# Altium schematic sheet Calibration.SchDoc
size A3
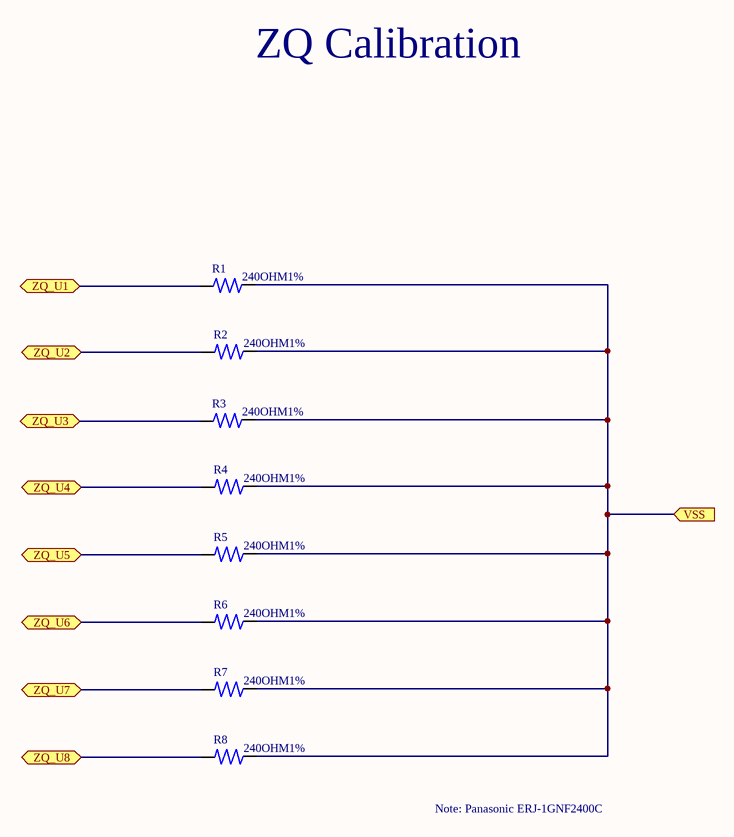
[diagram p0: Calibration.SchDoc]

## Parts
R1  Resistance: 240OHM1%  [Resistor 0402]  (hidden comment: Resistor 0402)
R2  Resistance: 240OHM1%  [Resistor 0402]  (hidden comment: Resistor 0402)
R3  Resistance: 240OHM1%  [Resistor 0402]  (hidden comment: Resistor 0402)
R4  Resistance: 240OHM1%  [Resistor 0402]  (hidden comment: Resistor 0402)
R5  Resistance: 240OHM1%  [Resistor 0402]  (hidden comment: Resistor 0402)
R6  Resistance: 240OHM1%  [Resistor 0402]  (hidden comment: Resistor 0402)
R7  Resistance: 240OHM1%  [Resistor 0402]  (hidden comment: Resistor 0402)
R8  Resistance: 240OHM1%  [Resistor 0402]  (hidden comment: Resistor 0402)

## Ports
VSS (in), ZQ_U1 (bidir), ZQ_U2 (bidir), ZQ_U3 (bidir), ZQ_U4 (bidir), ZQ_U5 (bidir), ZQ_U6 (bidir), ZQ_U7 (bidir), ZQ_U8 (bidir)

## Nets
VSS: R1.2 R2.2 R3.2 R4.2 R5.2 R6.2 R7.2 R8.2 ; port VSS
ZQ_U1: R1.1 ; port ZQ_U1
ZQ_U2: R2.1 ; port ZQ_U2
ZQ_U3: R3.1 ; port ZQ_U3
ZQ_U4: R4.1 ; port ZQ_U4
ZQ_U5: R5.1 ; port ZQ_U5
ZQ_U6: R6.1 ; port ZQ_U6
ZQ_U7: R7.1 ; port ZQ_U7
ZQ_U8: R8.1 ; port ZQ_U8

## Notes on the sheet
- ZQ Calibration
- Note: Panasonic ERJ-1GNF2400C

## Library data of the parts
R1-R8 = Resistor 0201: Manufacturer: Vishay; Manufacturer Part Number: CRCW060310K0FKEA; Max Power Dissipation: 100mW; Tolerance: 1%; Voltage Rating: 75V; Temperature Coefficient: 100ppm/°C; Supplier 1: Avnet Europe; Stock 1: 305000; Pricing 1: 5000=0.00444, 10000=0.00432, 20000=0.00421, 30000=0.0041, 40000=0.004 (EUR); Case/Package: 0201; Number of Pins: 2; Weight: 7.1E-05oz; Contact Plating: Tin,Lead; Case Code (Metric): 0603; Case Code (Imperial): 0201; Min Operating Temperature: -55°C; Max Operating Temperature: 155°C; Packaging: Tape and Reel; Package Quantity: 10; Termination: SMD/SMT; Power Rating: 100mW; Composition: Thick Film; Number of Terminations: 2; Military Standard: Not; Voltage Rating (DC): 75V; Features: Automotive AEC-Q200; Length: 1.55mm; Height: 0.45mm; Width: 0.033inch; Depth: 0.85mm; Radiation Hardening: No; REACH SVHC: Unknown; Lead Free: Lead Free; ComponentLink1URL: http://www.vishay.com/docs/20008/dcrcw.pdf?src-supplier=Avnet+Europe; ComponentLink1Description: http://www.vishay.com/docs/20008/dcrcw.pdf?src-supplier=Avnet+Europe; ComponentLink2URL: https://www.verical.com/server-webapp/html/getDatasheet?partID=86831&src-supplier=Verical; ComponentLink2Description: https://www.verical.com/server-webapp/html/getDatasheet?partID=86831&src-supplier=Verical; ComponentLink3URL: http://www.farnell.com/datasheets/2310790.pdf?src-supplier=Allied+Electronics; ComponentLink3Description: http://www.farnell.com/datasheets/2310790.pdf?src-supplier=Allied+Electronics; ComponentLink4URL: http://www.vishay.com/docs/20035/dcrcwe3.pdf?src-supplier=Digi-Key; ComponentLink4Description: http://www.vishay.com/docs/20035/dcrcwe3.pdf?src-supplier=Digi-Key; ComponentLink5URL: http://www.farnell.com/datasheets/2310790.pdf?src-supplier=Mouser; ComponentLink5Description: http://www.farnell.com/datasheets/2310790.pdf?src-supplier=Mouser; ComponentLink6URL: http://www.farnell.com/datasheets/2310790.pdf?src-supplier=Element14; ComponentLink6Description: http://www.farnell.com/datasheets/2310790.pdf?src-supplier=Element14; ComponentLink7URL: http://www.farnell.com/datasheets/2310790.pdf?src-supplier=Avnet; ComponentLink7Description: http://www.farnell.com/datasheets/2310790.pdf?src-supplier=Avnet; ComponentLink8URL: http://www.vishay.com/docs/20035/dcrcwe3.pdf?src-supplier=Future+Electronics; ComponentLink8Description: http://www.vishay.com/docs/20035/dcrcwe3.pdf?src-supplier=Future+Electronics; ComponentLink9URL: http://uk.rs-online.com/webdocs/0d98/0900766b80d98afc.pdf?src-supplier=RSComponents; ComponentLink9Description: http://uk.rs-online.com/webdocs/0d98/0900766b80d98afc.pdf?src-supplier=RSComponents; ComponentLink10URL: http://www.farnell.com/datasheets/2310790.pdf?src-supplier=Distrelec; ComponentLink10Description: http://www.farnell.com/datasheets/2310790.pdf?src-supplier=Distrelec